# EAGLE design Protoboard FeatherWing A1 Rev 01 (EAGLE 9.4.2)
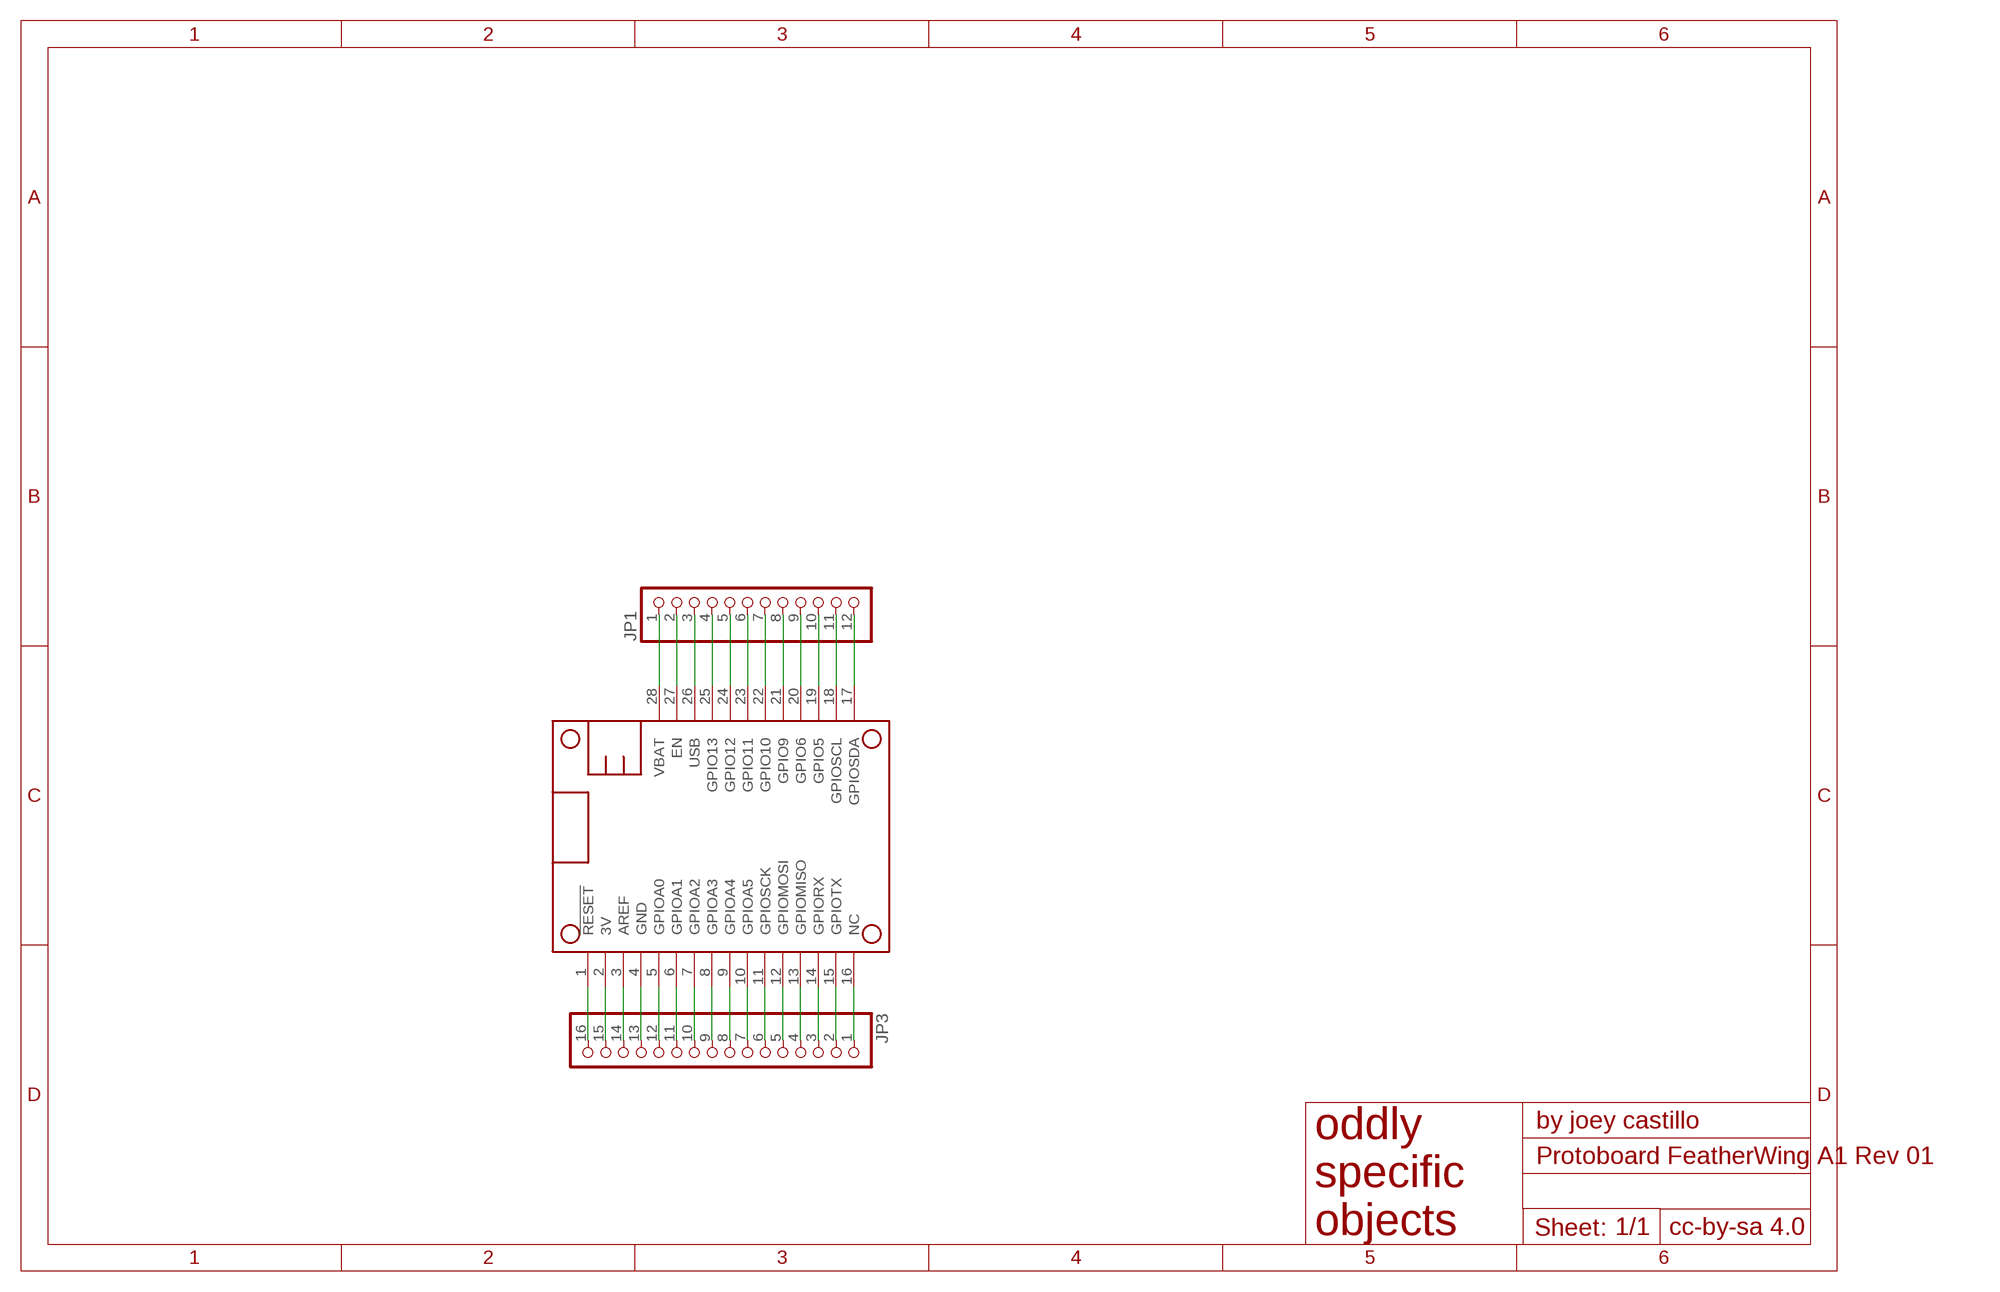
[diagram p0: schematic, sheet 1]

## Parts
JP1  HEADER-1X1276MIL  [1X12_ROUND_76MIL]
JP3  HEADER-1X16_76MIL  [1X16_ROUND_76MIL]
MS1  FEATHERWING  [FEATHERWING]

## Nets
3V: JP3.15 MS1.2(3V)
AREF: JP3.14 MS1.3(AREF)
GND: JP3.13 MS1.4(GND)
N$1: JP1.2 MS1.27(EN)
N$2: JP3.1 MS1.16(NC)
N$3: JP1.4 MS1.25(GPIO13)
N$4: JP3.2 MS1.15(GPIOTX)
N$5: JP1.5 MS1.24(GPIO12)
N$6: JP3.3 MS1.14(GPIORX)
N$7: JP3.4 MS1.13(GPIOMISO)
N$8: JP3.5 MS1.12(GPIOMOSI)
N$9: JP3.6 MS1.11(GPIOSCK)
N$10: JP3.7 MS1.10(GPIOA5)
N$11: JP3.8 MS1.9(GPIOA4)
N$12: JP3.9 MS1.8(GPIOA3)
N$13: JP3.10 MS1.7(GPIOA2)
N$14: JP3.11 MS1.6(GPIOA1)
N$15: JP3.12 MS1.5(GPIOA0)
N$18: JP3.16 MS1.1(!RESET)
N$19: JP1.6 MS1.23(GPIO11)
N$20: JP1.7 MS1.22(GPIO10)
N$21: JP1.8 MS1.21(GPIO9)
N$22: JP1.9 MS1.20(GPIO6)
N$23: JP1.10 MS1.19(GPIO5)
N$24: JP1.11 MS1.18(GPIOSCL)
N$25: JP1.12 MS1.17(GPIOSDA)
USB: JP1.3 MS1.26(USB)
VBAT: JP1.1 MS1.28(VBAT)

## Library data of the parts
JP1 = microbuilder:HEADER-1X12
JP3 = microbuilder:HEADER-1X16: PIN HEADER
MS1 = microbuilder:FEATHERWING

## Board
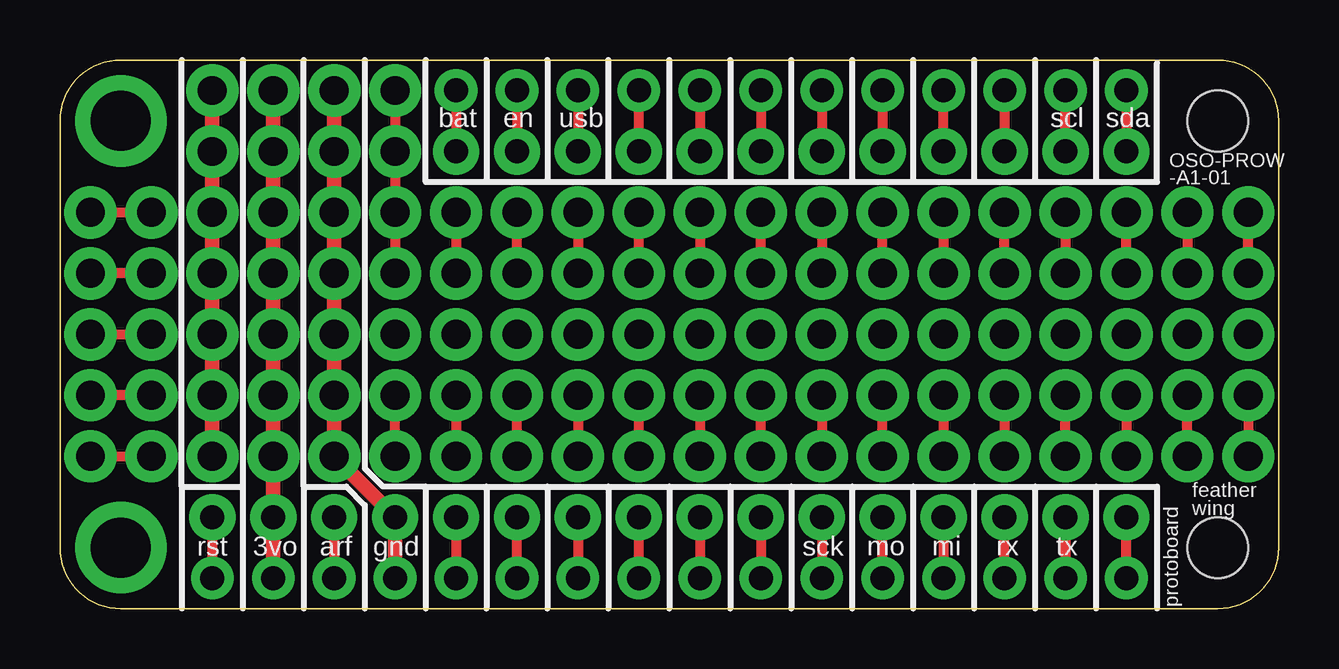
[diagram p1: board, top side]
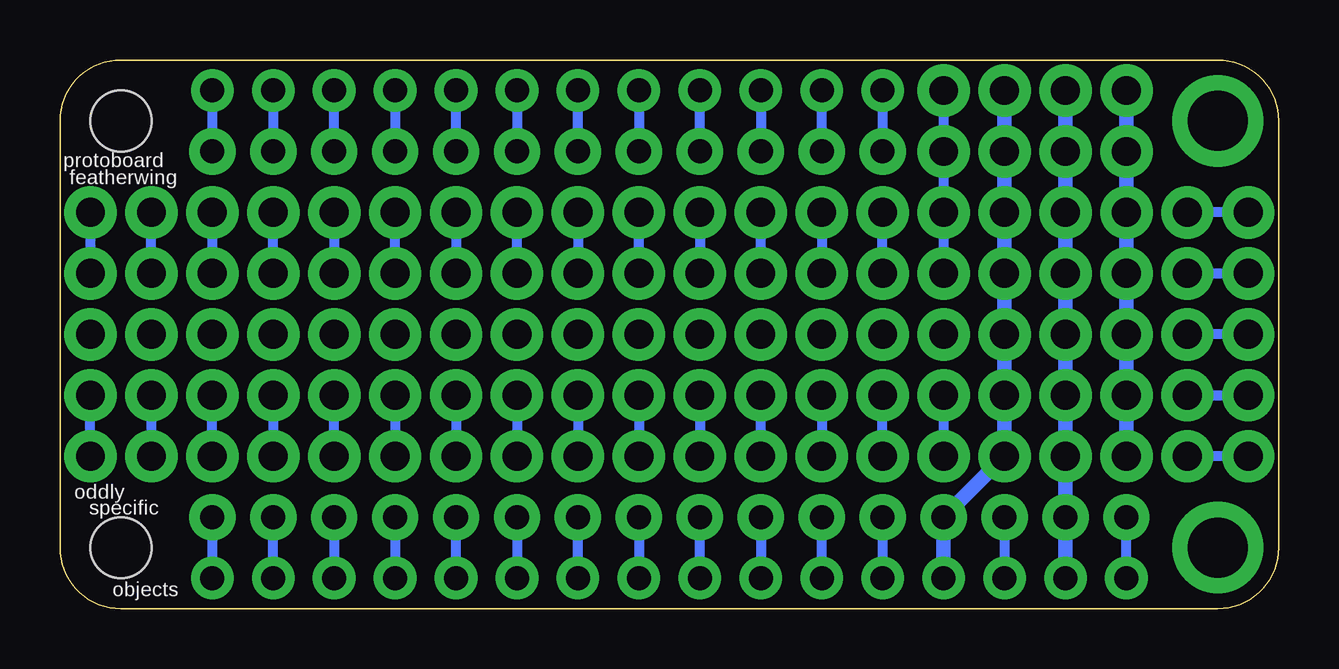
[diagram p2: board, bottom side, seen from below]

Size 50.8 x 22.86 mm. Coordinates in mm from the lower left corner, seen from the top.
Outline: 2.54,22.86 48.26,22.86 arc-90 50.8,20.32 50.8,2.54 arc-90 48.26,0 2.54,0 arc-90 0,2.54 0,20.32 arc-90 2.54,22.86
Copper layers (1*16): Top 0.035mm / dielectric 1.5mm / Bottom 0.035mm
Design rules "adafruit": minimum track width 8mil, minimum drill 15.5mil, track to track 8mil, track to pad 8mil, pad to pad 8mil, via to via 8mil, smd to smd 8mil, copper to edge 10mil, drill to drill 8mil, minimum pad ring 10mil, minimum via ring 8mil, stop-mask expansion 2mil, vias tented up to drill 20mil, thermal gap 10mil

### Footprints (pad centres in the part's own frame; a part is rotated, then mirrored left to right if it is on the bottom)
1X12_ROUND_76MIL = drill 1 pad 1.93: 1 -13.97,0; 2 -11.43,0; 3 -8.89,0; 4 -6.35,0; 5 -3.81,0; 6 -1.27,0; 7 1.27,0; 8 3.81,0; 9 6.35,0; 10 8.89,0; 11 11.43,0; 12 13.97,0
1X16_ROUND_76MIL = drill 1 pad 1.93: 1 -19.05,0; 2 -16.51,0; 3 -13.97,0; 4 -11.43,0; 5 -8.89,0; 6 -6.35,0; 7 -3.81,0; 8 -1.27,0; 9 1.27,0; 10 3.81,0; 11 6.35,0; 12 8.89,0; 13 11.43,0; 14 13.97,0; 15 16.51,0; 16 19.05,0
FEATHERWING = drill 1 pad 1.778: 1 6.35,1.27; 2 8.89,1.27; 3 11.43,1.27; 4 13.97,1.27; 5 16.51,1.27; 6 19.05,1.27; 7 21.59,1.27; 8 24.13,1.27; 9 26.67,1.27; 10 29.21,1.27; 11 31.75,1.27; 12 34.29,1.27; 13 36.83,1.27; 14 39.37,1.27; 15 41.91,1.27; 16 44.45,1.27; 17 44.45,21.59; 18 41.91,21.59; 19 39.37,21.59; 20 36.83,21.59; 21 34.29,21.59; 22 31.75,21.59; 23 29.21,21.59; 24 26.67,21.59; 25 24.13,21.59; 26 21.59,21.59; 27 19.05,21.59; 28 16.51,21.59 | drill 2.5 pad 3.81: P$1 2.54,20.32; P$2 2.54,2.54 | hole 2.54: 48.26,20.32; 48.26,2.54

### Placement (x,y rotation side)
JP1  30.48,19.05 0 top
JP3  25.4,3.81 180 top
MS1  0,0 0 top

### Tracks (layer width: path | path; a pad name or v marks a point on that pad's centre or on a via)
1H  (via drill 1.2 pad 2.18)
  Top 0.406: v13.97,21.59 v13.97,19.05 v13.97,16.51 v13.97,13.97
  Bottom 0.406: v13.97,21.59 v13.97,19.05 v13.97,16.51 v13.97,13.97
1L  (via drill 1.2 pad 2.18)
  Top 0.406: v13.97,6.35 v13.97,8.89
  Bottom 0.406: v13.97,8.89 v13.97,6.35
2H  (via drill 1.2 pad 2.18)
  Top 0.406: v16.51,16.51 v16.51,13.97
  Bottom 0.406: v16.51,13.97 v16.51,16.51
2L  (via drill 1.2 pad 2.18)
  Top 0.406: v16.51,8.89 v16.51,6.35
  Bottom 0.406: v16.51,6.35 v16.51,8.89
3H  (via drill 1.2 pad 2.18)
  Top 0.406: v19.05,13.97 v19.05,16.51
  Bottom 0.406: v19.05,16.51 v19.05,13.97
3L  (via drill 1.2 pad 2.18)
  Top 0.406: v19.05,6.35 v19.05,8.89
  Bottom 0.406: v19.05,8.89 v19.05,6.35
3V  (via drill 1.2 pad 2.18)
  Top 0.61: v8.89,21.59 v8.89,19.05 v8.89,16.51 v8.89,13.97 v8.89,11.43 v8.89,8.89 v8.89,6.35 JP3.15 MS1.2
  Bottom 0.61: MS1.2 JP3.15 v8.89,6.35 v8.89,8.89 v8.89,11.43 v8.89,13.97 v8.89,16.51 v8.89,19.05 v8.89,21.59
4H  (via drill 1.2 pad 2.18)
  Top 0.406: v21.59,16.51 v21.59,13.97
  Bottom 0.406: v21.59,13.97 v21.59,16.51
4L  (via drill 1.2 pad 2.18)
  Top 0.406: v21.59,8.89 v21.59,6.35
  Bottom 0.406: v21.59,6.35 v21.59,8.89
5H  (via drill 1.2 pad 2.18)
  Top 0.406: v24.13,13.97 v24.13,16.51
  Bottom 0.406: v24.13,16.51 v24.13,13.97
5L  (via drill 1.2 pad 2.18)
  Top 0.406: v24.13,6.35 v24.13,8.89
  Bottom 0.406: v24.13,8.89 v24.13,6.35
6H  (via drill 1.2 pad 2.18)
  Top 0.406: v26.67,16.51 v26.67,13.97
  Bottom 0.406: v26.67,13.97 v26.67,16.51
6L  (via drill 1.2 pad 2.18)
  Top 0.406: v26.67,8.89 v26.67,6.35
  Bottom 0.406: v26.67,8.89 v26.67,6.35
7H  (via drill 1.2 pad 2.18)
  Top 0.406: v29.21,13.97 v29.21,16.51
  Bottom 0.406: v29.21,16.51 v29.21,13.97
7L  (via drill 1.2 pad 2.18)
  Top 0.406: v29.21,6.35 v29.21,8.89
  Bottom 0.406: v29.21,8.89 v29.21,6.35
8H  (via drill 1.2 pad 2.18)
  Top 0.406: v31.75,16.51 v31.75,13.97
  Bottom 0.406: v31.75,13.97 v31.75,16.51
8L  (via drill 1.2 pad 2.18)
  Top 0.406: v31.75,8.89 v31.75,6.35
  Bottom 0.406: v31.75,8.89 v31.75,6.35
9H  (via drill 1.2 pad 2.18)
  Top 0.406: v34.29,13.97 v34.29,16.51
  Bottom 0.406: v34.29,16.51 v34.29,13.97
9L  (via drill 1.2 pad 2.18)
  Top 0.406: v34.29,6.35 v34.29,8.89
  Bottom 0.406: v34.29,8.89 v34.29,6.35
10H  (via drill 1.2 pad 2.18)
  Top 0.406: v36.83,16.51 v36.83,13.97
  Bottom 0.406: v36.83,13.97 v36.83,16.51
10L  (via drill 1.2 pad 2.18)
  Top 0.406: v36.83,8.89 v36.83,6.35
  Bottom 0.406: v36.83,8.89 v36.83,6.35
11H  (via drill 1.2 pad 2.18)
  Top 0.406: v39.37,13.97 v39.37,16.51
  Bottom 0.406: v39.37,16.51 v39.37,13.97
11L  (via drill 1.2 pad 2.18)
  Top 0.406: v39.37,8.89 v39.37,6.35
  Bottom 0.406: v39.37,6.35 v39.37,8.89
12H  (via drill 1.2 pad 2.18)
  Top 0.406: v41.91,16.51 v41.91,13.97
  Bottom 0.406: v41.91,13.97 v41.91,16.51
12L  (via drill 1.2 pad 2.18)
  Top 0.406: v41.91,6.35 v41.91,8.89
  Bottom 0.406: v41.91,8.89 v41.91,6.35
13H  (via drill 1.2 pad 2.18)
  Top 0.406: v44.45,13.97 v44.45,16.51
  Bottom 0.406: v44.45,16.51 v44.45,13.97
13L  (via drill 1.2 pad 2.18)
  Top 0.406: v44.45,8.89 v44.45,6.35
  Bottom 0.406: v44.45,6.35 v44.45,8.89
14H  (via drill 1.2 pad 2.18)
  Top 0.406: v46.99,16.51 v46.99,13.97
  Bottom 0.406: v46.99,13.97 v46.99,16.51
14L  (via drill 1.2 pad 2.18)
  Top 0.406: v46.99,6.35 v46.99,8.89
  Bottom 0.406: v46.99,8.89 v46.99,6.35
15H  (via drill 1.2 pad 2.18)
  Top 0.406: v49.53,13.97 v49.53,16.51
  Bottom 0.406: v49.53,16.51 v49.53,13.97
15L  (via drill 1.2 pad 2.18)
  Top 0.406: v49.53,8.89 v49.53,6.35
  Bottom 0.406: v49.53,6.35 v49.53,8.89
16  (via drill 1.2 pad 2.18)
  Top 0.406: v1.27,16.51 v3.81,16.51
  Bottom 0.406: v1.27,16.51 v3.81,16.51
17  (via drill 1.2 pad 2.18)
  Top 0.406: v3.81,13.97 v1.27,13.97
  Bottom 0.406: v3.81,13.97 v1.27,13.97
18  (via drill 1.2 pad 2.18)
  Top 0.406: v1.27,11.43 v3.81,11.43
  Bottom 0.406: v1.27,11.43 v3.81,11.43
19  (via drill 1.2 pad 2.18)
  Top 0.406: v3.81,8.89 v1.27,8.89
  Bottom 0.406: v3.81,8.89 v1.27,8.89
20  (via drill 1.2 pad 2.18)
  Top 0.406: v1.27,6.35 v3.81,6.35
  Bottom 0.406: v1.27,6.35 v3.81,6.35
AREF
  Top 0.406: JP3.14 MS1.3
  Bottom 0.406: JP3.14 MS1.3
GND  (via drill 1.2 pad 2.18)
  Top 0.61: v11.43,21.59 v11.43,19.05 v11.43,16.51 v11.43,13.97 v11.43,11.43 v11.43,8.89 v11.43,6.35 JP3.13 MS1.4
  Bottom 0.61: MS1.4 JP3.13 v11.43,6.35 v11.43,8.89 v11.43,11.43 v11.43,13.97 v11.43,16.51 v11.43,19.05 v11.43,21.59
N$1
  Top 0.406: MS1.27 JP1.2
  Bottom 0.406: JP1.2 MS1.27
N$2
  Top 0.406: MS1.16 JP3.1
  Bottom 0.406: JP3.1 MS1.16
N$3
  Top 0.406: JP1.4 MS1.25
  Bottom 0.406: JP1.4 MS1.25
N$4
  Top 0.406: JP3.2 MS1.15
  Bottom 0.406: MS1.15 JP3.2
N$5
  Top 0.406: MS1.24 JP1.5
  Bottom 0.406: MS1.24 JP1.5
N$6
  Top 0.406: MS1.14 JP3.3
  Bottom 0.406: JP3.3 MS1.14
N$7
  Top 0.406: JP3.4 MS1.13
  Bottom 0.406: JP3.4 MS1.13
N$8
  Top 0.406: MS1.12 JP3.5
  Bottom 0.406: MS1.12 JP3.5
N$9
  Top 0.406: JP3.6 MS1.11
  Bottom 0.406: JP3.6 MS1.11
N$10
  Top 0.406: JP3.7 MS1.10
  Bottom 0.406: MS1.10 JP3.7
N$11
  Top 0.406: JP3.8 MS1.9
  Bottom 0.406: JP3.8 MS1.9
N$12
  Top 0.406: MS1.8 JP3.9
  Bottom 0.406: MS1.8 JP3.9
N$13
  Top 0.406: JP3.10 MS1.7
  Bottom 0.406: JP3.10 MS1.7
N$14
  Top 0.406: MS1.6 JP3.11
  Bottom 0.406: MS1.6 JP3.11
N$15
  Top 0.406: JP3.12 MS1.5
  Bottom 0.406: JP3.12 MS1.5
N$18
  Top 0.406: JP3.16 MS1.1
  Bottom 0.406: MS1.1 JP3.16
N$19
  Top 0.406: MS1.23 JP1.6
  Bottom 0.406: JP1.6 MS1.23
N$20
  Top 0.406: MS1.22 JP1.7
  Bottom 0.406: MS1.22 JP1.7
N$21
  Top 0.406: MS1.21 JP1.8
  Bottom 0.406: JP1.8 MS1.21
N$22
  Top 0.406: JP1.9 MS1.20
  Bottom 0.406: MS1.20 JP1.9
N$23
  Top 0.406: MS1.19 JP1.10
  Bottom 0.406: JP1.10 MS1.19
N$24
  Top 0.406: JP1.11 MS1.18
  Bottom 0.406: MS1.18 JP1.11
N$25
  Top 0.406: MS1.17 JP1.12
  Bottom 0.406: MS1.17 JP1.12
N$57  (via drill 1.2 pad 2.18)
  other vias: 13.97,11.43
N$68  (via drill 1.2 pad 2.18)
  other vias: 16.51,11.43
N$73  (via drill 1.2 pad 2.18)
  other vias: 19.05,11.43
N$76  (via drill 1.2 pad 2.18)
  other vias: 21.59,11.43
N$83  (via drill 1.2 pad 2.18)
  other vias: 24.13,11.43
N$86  (via drill 1.2 pad 2.18)
  other vias: 26.67,11.43
N$91  (via drill 1.2 pad 2.18)
  other vias: 29.21,11.43
N$96  (via drill 1.2 pad 2.18)
  other vias: 31.75,11.43
N$101  (via drill 1.2 pad 2.18)
  other vias: 34.29,11.43
N$106  (via drill 1.2 pad 2.18)
  other vias: 36.83,11.43
N$111  (via drill 1.2 pad 2.18)
  other vias: 39.37,11.43
N$117  (via drill 1.2 pad 2.18)
  other vias: 41.91,11.43
N$121  (via drill 1.2 pad 2.18)
  other vias: 44.45,11.43
N$127  (via drill 1.2 pad 2.18)
  other vias: 49.53,11.43
N$132  (via drill 1.2 pad 2.18)
  other vias: 46.99,11.43
PWR  (via drill 1.2 pad 2.18)
  Top 0.61: v6.35,21.59 v6.35,19.05 v6.35,16.51 v6.35,13.97 v6.35,11.43 v6.35,8.89 v6.35,6.35
  Bottom 0.61: v6.35,21.59 v6.35,19.05 v6.35,16.51 v6.35,13.97 v6.35,11.43 v6.35,8.89 v6.35,6.35
USB
  Top 0.406: MS1.26 JP1.3
  Bottom 0.406: MS1.26 JP1.3
VBAT
  Top 0.406: MS1.28 JP1.1
  Bottom 0.406: MS1.28 JP1.1

### Text on the board
tPlace: bat | en | usb | scl | sda | -A1-01 | OSO-PROW | feather | wing | rst | 3vo | arf | gnd | sck | mo | mi | rx | tx | protoboard
bPlace: featherwing | protoboard | oddly | specific | objects